# EAGLE design MegaSheild2 (EAGLE 7.3.0)
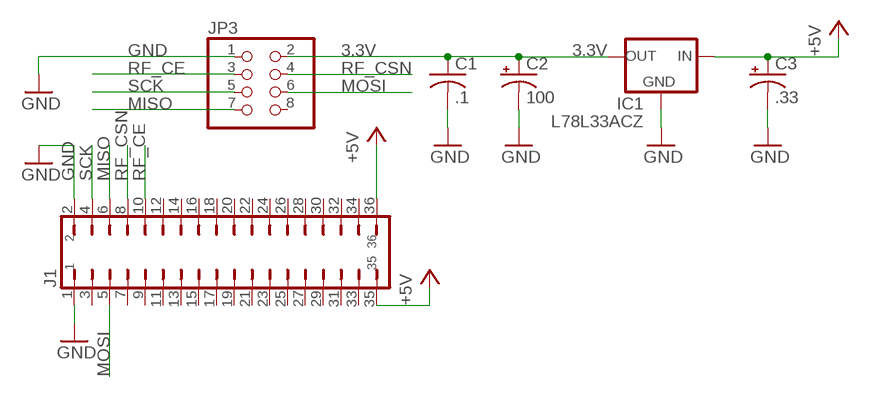
[diagram p0: schematic, sheet 1]

## Parts
C1  .1  C-US025-024X044  [C025-024X044]
C2  100  CPOL-USE2.5-6  [E2,5-6]
C3  .33  CPOL-USE1.8-4  [E1,8-4]
IC1  L78L33ACZ  78LXX  [78LXX]
J1  JP18Q2X18BIG  [2X18-BIG]
JP3  PINHD-2X4  [2X04]

## Nets
3.3V [RFBoard]: C1.1 C2.+ IC1.OUT JP3.2
+5V [RFBoard]: C3.+ IC1.IN J1.35 J1.36
GND [RFBoard]: C1.2 C2.- C3.- IC1.GND J1.1 J1.2 JP3.1
MISO [RFBoard]: J1.6 JP3.7
MOSI [RFBoard]: J1.5 JP3.6
RF_CE [RFBoard]: J1.10 JP3.3
RF_CSN [RFBoard]: J1.8 JP3.4
SCK [RFBoard]: J1.4 JP3.5
Unconnected: J1.3 J1.7 J1.9 J1.11 J1.12 J1.13 J1.14 J1.15 J1.16 J1.17 J1.18 J1.19 J1.20 J1.21 J1.22 J1.23 J1.24 J1.25 J1.26 J1.27 J1.28 J1.29 J1.30 J1.31 J1.32 J1.33 J1.34 JP3.8

## Library data of the parts
C1 = adafruit:C-US: CAPACITOR, American symbol
C2 C3 = adafruit:CPOL-US: POLARIZED CAPACITOR, American symbol
IC1 = v-reg:78LXX: VOLTAGE REGULATOR
J1 = tim:JP18Q: JUMPER
JP3 = adafruit:PINHD-2X4: PIN HEADER

## Net classes
1 RFBoard: width 0.406 mm

## Board
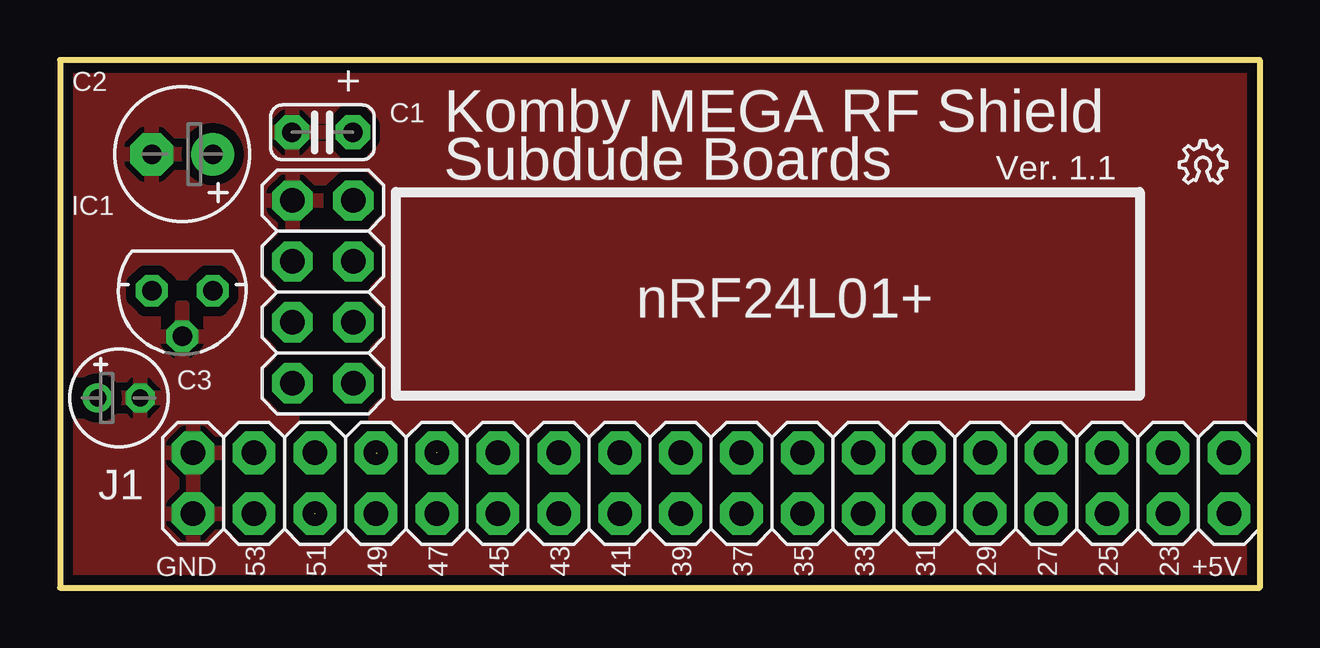
[diagram p1: board, top side]
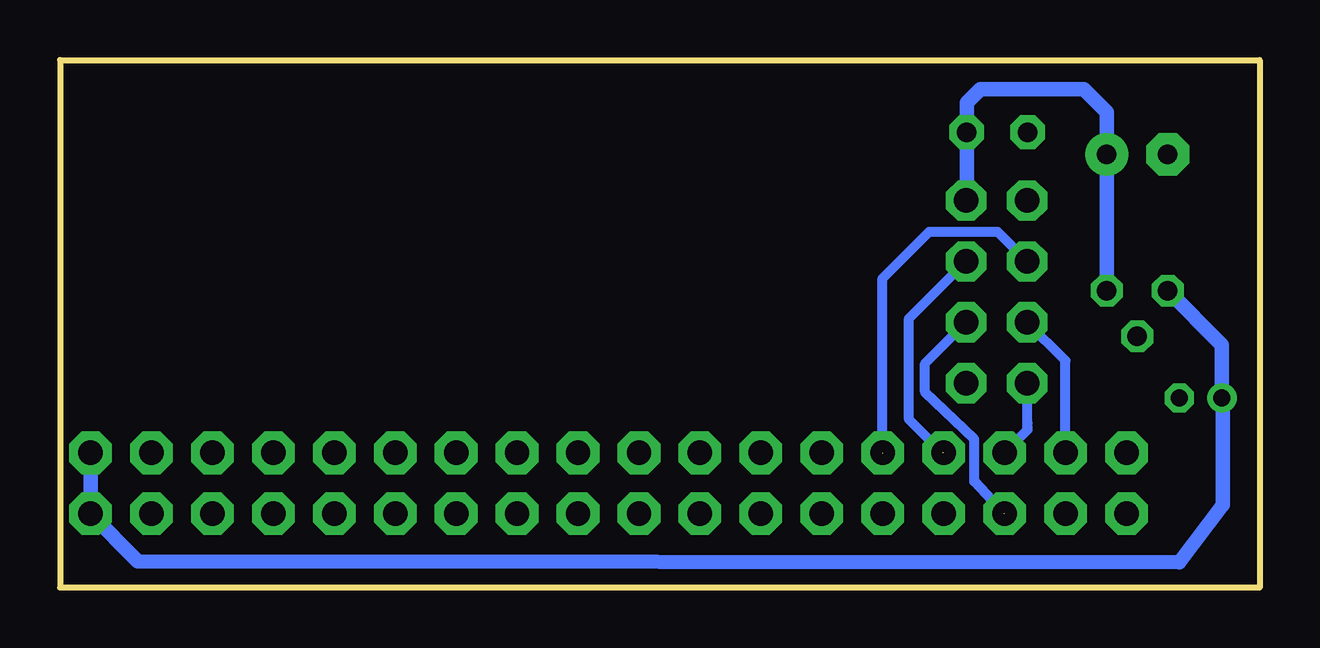
[diagram p2: board, bottom side, seen from below]

Size 50 x 22 mm. Coordinates in mm from the lower left corner, seen from the top.
Outline: 0,0 50,0 50,22 0,22 0,0
Copper layers (1*16): Top 0.035mm / dielectric 1.5mm / Bottom 0.035mm
Design rules "dirty": minimum track width 5mil, minimum drill 12mil, track to track 5mil, track to pad 5mil, pad to pad 5mil, via to via 5mil, smd to smd 0mil, copper to edge 10mil, drill to drill 10mil, minimum pad ring 10mil, minimum via ring 6mil, stop-mask expansion 2mil, vias tented up to drill 25mil, thermal gap 10mil

### Footprints (pad centres in the part's own frame; a part is rotated, then mirrored left to right if it is on the bottom)
C025-024X044 = drill 0.813 pad 1.422 octagon: 1 -1.27,0; 2 1.27,0
E2,5-6 = drill 0.813 pad 1.778: + -1.27,0 | drill 0.813 pad 1.778 octagon: - 1.27,0
E1,8-4 = drill 0.711 pad 1.168: + -0.889,0 | drill 0.711 pad 1.168 octagon: - 0.889,0
78LXX = drill 0.813 octagon: GND 0,1.905; IN 1.27,0; OUT -1.27,0
2X18-BIG = drill 1.016 pad 1.778 octagon: 1 -21.59,-1.27; 2 -21.59,1.27; 3 -19.05,-1.27; 4 -19.05,1.27; 5 -16.51,-1.27; 6 -16.51,1.27; 7 -13.97,-1.27; 8 -13.97,1.27; 9 -11.43,-1.27; 10 -11.43,1.27; 11 -8.89,-1.27; 12 -8.89,1.27; 13 -6.35,-1.27; 14 -6.35,1.27; 15 -3.81,-1.27; 16 -3.81,1.27; 17 -1.27,-1.27; 18 -1.27,1.27; 19 1.27,-1.27; 20 1.27,1.27; 21 3.81,-1.27; 22 3.81,1.27; 23 6.35,-1.27; 24 6.35,1.27; 25 8.89,-1.27; 26 8.89,1.27; 27 11.43,-1.27; 28 11.43,1.27; 29 13.97,-1.27; 30 13.97,1.27; 31 16.51,-1.27; 32 16.51,1.27; 33 19.05,-1.27; 34 19.05,1.27; 35 21.59,-1.27; 36 21.59,1.27
2X04 = drill 1.016 pad 1.676 octagon: 1 -3.81,-1.27; 2 -3.81,1.27; 3 -1.27,-1.27; 4 -1.27,1.27; 5 1.27,-1.27; 6 1.27,1.27; 7 3.81,-1.27; 8 3.81,1.27

### Placement (x,y rotation side)
C1  10.94,18.98 180 top
C2  5.1,18.07 180 top
C3  2.45,7.91 0 top
IC1  5.1,12.38 180 top
J1  27.14,4.35 0 top
JP3  10.96,12.33 270 top
U$1  [OSHW_6X70_NOTEXT]  46.65,16.86 0 top

### Tracks (layer width: path | path; a pad name or v marks a point on that pad's centre or on a via)
3.3V
  Bottom 0.61: IC1.OUT C2.+ 6.37,19.83 7.32,20.78 11.63,20.78 12.19,20.22 12.19,19.02 C1.1 12.21,16.16 JP3.2
+5V
  Bottom 0.61: 46.75,1.1 3.34,1.05 1.54,3.44 1.54,7.88 C3.+ 1.56,10.12 IC1.IN | J1.36 J1.35 46.75,1.1 | 46.75,1.1
GND
  pour Top (isolate 0.406): 0.3,21.69 0.3,0.3 49.68,0.3 49.68,21.64 0.41,21.64
MISO
  Bottom 0.406: JP3.7 9.67,8.4 9.67,6.86 9.67,6.69 9.67,6.58 J1.6
MOSI  (1 unrouted)
  Bottom 0.406: J1.5 10.66,3.09 11.89,4.42 11.89,6.2 13.95,8.15 13.95,9.34 JP3.6
RF_CE  (1 unrouted)
  Bottom 0.406: JP3.3 10.92,14.83 13.77,14.83 15.71,12.89 J1.10
RF_CSN  (1 unrouted)
  Bottom 0.406: 13.22,5.62 14.61,7.01 14.61,11.22 JP3.4
SCK
  Bottom 0.406: JP3.5 8.09,9.46 J1.4

### Text on the board
tPlace: + | Komby MEGA RF Shield | Subdude Boards | Ver. 1.1
tNames: nRF24L01+ | 53 | 51 | 49 | 47 | 45 | 43 | 41 | 39 | 37 | 35 | 33 | 31 | 29 | 27 | 25 | 23 | GND | +5V